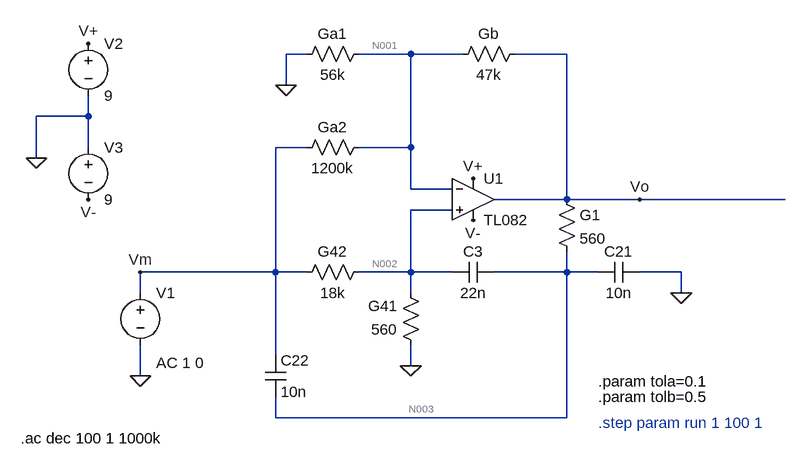
[diagram p0: schematic Sedra Etapa1.asc]
* Sedra Etapa1.asc
R§G42 N002 Vm 18k
R§G41 0 N002 560
R§Ga2 Vm N001 1200k
R§Ga1 0 N001 56k
R§Gb N001 Vo 47k
R§G1 Vo N003 560
* U1: TL082 (symbol PAULOlib\TL082 not available, pins judged from their places): In+=N002 In-=N001 V+=V+ V-=V- OUT=Vo
C3 N003 N002 22n
C22 Vm N003 10n
C21 0 N003 10n
V1 Vm 0 AC 1 0
V2 V+ 0 9
V3 0 V- 9
.param tola=0.1
.param tolb=0.5
* .step param run 1 100 1
.ac dec 100 1 1000k
.backanno
.end

* Results of the author's LTspice run, read from the files saved beside the schematic
* Operating Point, zero values left out:
*   V(n002) = -21.21 nV
*   V(n001) = 10.95 µV
*   V(vo) = 22.4 µV
*   V(n003) = 22.4 µV
*   V(v-) = -9 V
*   V(v+) = 9 V
*   I(Gb) = -243.7 pA
*   I(Ga1) = -195.5 pA
*   I(Ga2) = -9.124 pA
*   I(G41) = 37.87 pA
*   I(G42) = -1.178 pA
*   I(V3) = -8.595 mA
*   I(V2) = -8.594 mA
*   I(V1) = 7.946 pA
*   Ix(u1:1) = 39.05 pA
*   Ix(u1:2) = 39.05 pA
*   Ix(u1:3) = 8.594 mA
*   Ix(u1:4) = -8.595 mA
*   Ix(u1:5) = -243.7 pA
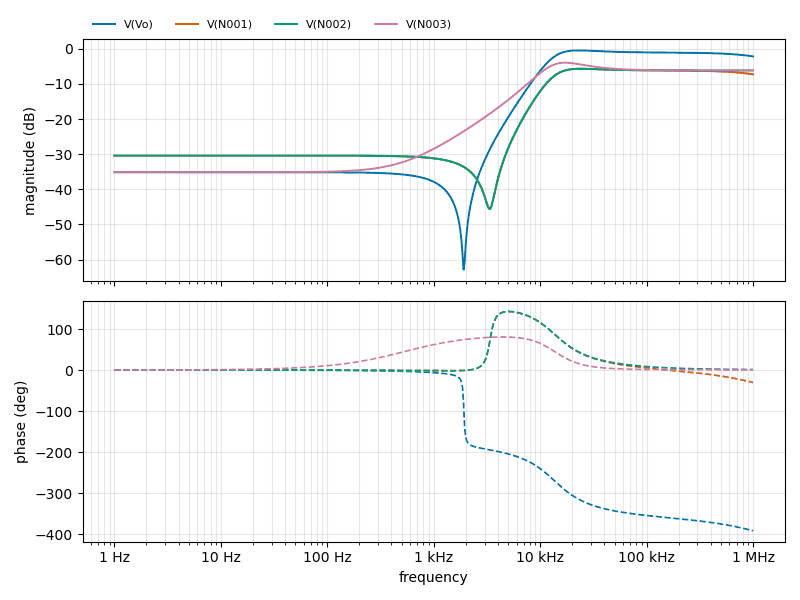
[diagram p1: AC Analysis of Sedra Etapa1.asc, plotted from the saved traces]
* AC Analysis, 1 run:
*   V(Vo): -35.13 dB at 1 Hz, -2.15 dB at 1 MHz, peak -0.44 dB at 22.91 kHz, 3 dB below the peak at 12.11 kHz
*   V(N001): -30.41 dB at 1 Hz, -7.26 dB at 1 MHz, peak -5.66 dB at 23.99 kHz, 3 dB below the peak at 12.44 kHz
*   V(N002): -30.41 dB at 1 Hz, -6.13 dB at 1 MHz, peak -5.67 dB at 23.99 kHz, 3 dB below the peak at 12.44 kHz
*   V(N003): -35.13 dB at 1 Hz, -6.13 dB at 1 MHz, peak -3.94 dB at 16.98 kHz, 3 dB below the peak at 9.947 kHz